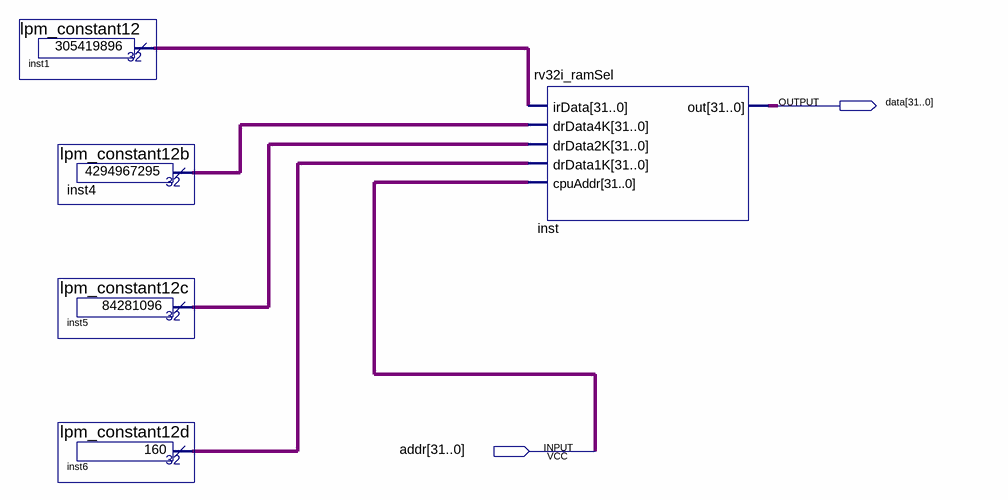
[diagram p0: schematic sheet]
// Quartus schematic rv32i_ramSel_tester.bdf as structural Verilog: 5 symbols, 2 pins
module rv32i_ramSel_tester (
  input  [31:0] addr,
  output [31:0] data
);

  wire [31:0] inst1_result, inst4_result, inst5_result, inst6_result;

  lpm_constant12 inst1 (.result(inst1_result));
  lpm_constant12b inst4 (.result(inst4_result));
  lpm_constant12c inst5 (.result(inst5_result));
  lpm_constant12d inst6 (.result(inst6_result));
  rv32i_ramSel inst (
    .irData(inst1_result), .drData4K(inst4_result), .drData2K(inst5_result), .drData1K(inst6_result),
    .cpuAddr(addr), .out(data));
endmodule
